# Altium schematic sheet Boost-Converter for OLED Interfce.SchDoc
size A4; SheetNumber: 4; SheetTotal: 5
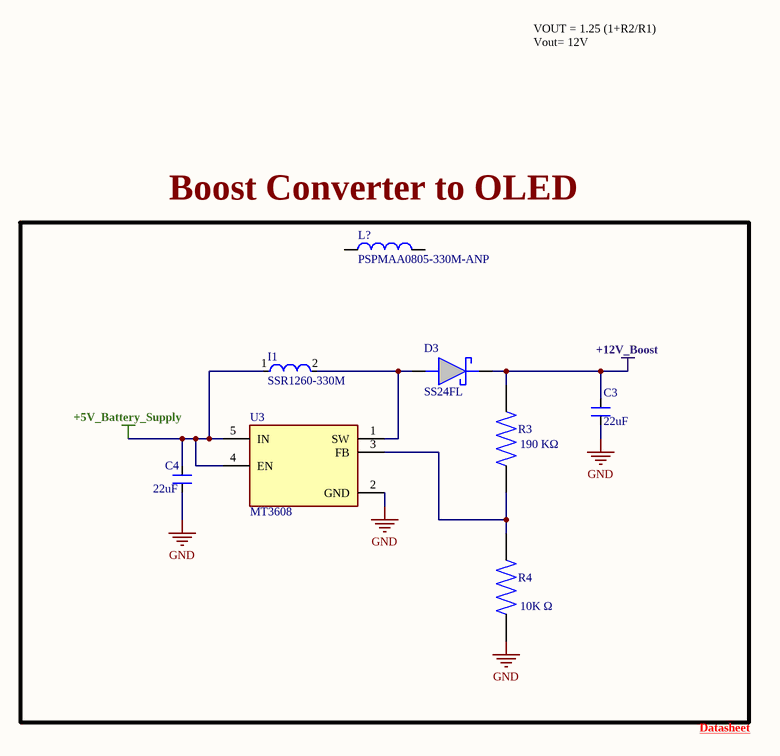
[diagram p0: Boost-Converter for OLED Interfce.SchDoc]

## Parts
C3  22uF  [RES_0603]
C4  22uF  [RES_0603]
D3  SS24FL  [Diode SS24FL]
I1  SSR1260-330M  [IND_33uH_60m_Ohm_3A]
L?  PSPMAA0805-330M-ANP  [IND 8.5x8mm]
R3  ERJU03J106V  [RES 0603 Panasonic]  (value not drawn)
R4  ERJU03J106V  [RES 0603 Panasonic]  (value not drawn)
U3  MT3608  [SOT95P280X145-6N]

## Nets
+5V_Battery_Supply: C4.2 I1.1 U3.4(EN) U3.5(IN)
+12V_Boost: C3.2 D3.C R3.2
GND: C3.1 C4.1 R4.1 U3.2(GND)
NetD3_A: D3.A I1.2 U3.1(SW)
NetR3_1: R3.1 R4.2 U3.3(FB)

Not connected (* = marked no-connect by the designer): L? 1 2

## Notes on the sheet
- VOUT = 1.25 (1+R2/R1)
  Vout= 12V
- (near R3) 190 KΩ
- (near R4) 10K Ω
- Datasheet <https://www.lcsc.com/datasheet/C84817.pdf>
- Labels drawn without touching a wire or pin: Boost Converter to OLED

## Library data of the parts
C3 C4 = CAP_GENERIC_0603_1: Ceramic Capacitor C0G, NP0 0603 (2012 Metric); Manufacturer: Yageo; Manufacturer Part Number: 600F1R0BT250XT; Alternate Part Number-1: NA; Case/Package: 0805; Supplier-1: Mouser; Supplier Part Number-1: 581-600F1R0BT
D3 = DIO - Schottky Diodes & Rectifiers 40V 2A: Schottky Diodes & Rectifiers 40V, 2A SCHOTTKY
I1 = IND_33uH_60m_Ohm_3A: IND FIXED IND 33UH 3A 60 MOHM SMD; Manufacturer: BOURNS; Manufacturer  PN: SRR1260-330M; Supplier: LCSC; Supplier  PN: C840528
L? = IND-33uH 111m Ohm 6A: 3.5A 33uH 111mΩ 6A ±20% SMD,8.5x8mm Fixed Inductors RoHS
R3 R4 = RES 0603 Panasonic: 0201 anti-sulfurated resistor 0603 Anti-Sulfurated
U3 = IC- Dc-Dc Boost converter: The MT3608 is a constant frequency, 6-pin SOT23 / current mode step-up converter intended for small, / low power applications.; Manufacturer: AEROSEMI; Manufacturer  PN: MT3608; Supplier: LCSC; Supplier  PN: C84817